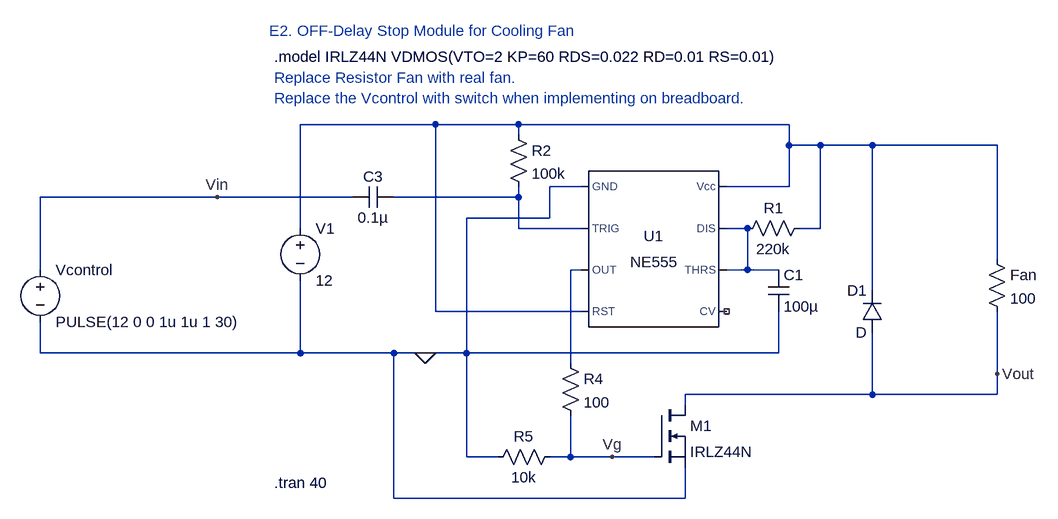
[diagram p0: schematic OFF-Delay Stop Module for DC Load .asc]
OFF-Delay Stop Module for DC Load .asc, the LTspice schematic file:
Version 4
SHEET 1 1632 688
WIRE 512 -16 304 -16
WIRE 640 -16 512 -16
WIRE 1056 -16 640 -16
WIRE 640 0 640 -16
WIRE 1056 16 1056 -16
WIRE 1104 16 1056 16
WIRE 1184 16 1104 16
WIRE 1376 16 1184 16
WIRE 736 80 688 80
WIRE 1056 80 1056 16
WIRE 1056 80 960 80
WIRE 176 96 -96 96
WIRE 384 96 176 96
WIRE 640 96 640 80
WIRE 640 96 448 96
WIRE 688 128 688 80
WIRE 688 128 560 128
WIRE 304 144 304 -16
WIRE 640 144 640 96
WIRE 736 144 640 144
WIRE 992 144 960 144
WIRE 1104 144 1104 16
WIRE 1104 144 1072 144
WIRE 1376 192 1376 16
WIRE -96 208 -96 96
WIRE 736 208 720 208
WIRE 992 208 992 144
WIRE 992 208 960 208
WIRE 1040 208 992 208
WIRE 1184 240 1184 16
WIRE 512 272 512 -16
WIRE 736 272 512 272
WIRE -96 336 -96 288
WIRE 304 336 304 224
WIRE 304 336 -96 336
WIRE 448 336 304 336
WIRE 496 336 448 336
WIRE 560 336 560 128
WIRE 560 336 496 336
WIRE 1040 336 1040 272
WIRE 1040 336 560 336
WIRE 720 352 720 208
WIRE 1376 368 1376 272
WIRE 1184 400 1184 304
WIRE 1184 400 896 400
WIRE 1376 400 1376 368
WIRE 1376 400 1184 400
WIRE 896 416 896 400
WIRE 560 496 560 336
WIRE 608 496 560 496
WIRE 720 496 720 432
WIRE 720 496 688 496
WIRE 784 496 720 496
WIRE 848 496 784 496
WIRE 448 560 448 336
WIRE 896 560 896 512
WIRE 896 560 448 560
FLAG 496 336 0
FLAG 1376 368 Vout
FLAG 784 496 Vg
FLAG 176 96 Vin
SYMBOL Misc\\NE555 848 176 R0
SYMATTR InstName U1
SYMBOL voltage 304 128 R0
SYMATTR InstName V1
SYMATTR Value 12
SYMBOL res 1088 128 R90
WINDOW 0 0 56 VBottom 2
WINDOW 3 32 56 VTop 2
SYMATTR InstName R1
SYMATTR Value 220k
SYMBOL cap 1024 208 R0
SYMATTR InstName C1
SYMATTR Value 100µ
SYMBOL res 624 -16 R0
SYMATTR InstName R2
SYMATTR Value 100k
SYMBOL voltage -96 192 R0
SYMATTR InstName Vcontrol
SYMATTR Value PULSE(12 0 0 1u 1u 1 30)
SYMBOL cap 448 80 R90
WINDOW 0 0 32 VBottom 2
WINDOW 3 32 32 VTop 2
SYMATTR InstName C3
SYMATTR Value 0.1µ
SYMBOL res 704 336 R0
SYMATTR InstName R4
SYMATTR Value 100
SYMBOL nmos 848 416 R0
SYMATTR InstName M1
SYMATTR Value IRLZ44N
SYMBOL res 704 480 R90
WINDOW 0 0 56 VBottom 2
WINDOW 3 32 56 VTop 2
SYMATTR InstName R5
SYMATTR Value 10k
SYMBOL diode 1200 304 R180
WINDOW 0 24 64 Left 2
WINDOW 3 24 0 Left 2
SYMATTR InstName D1
SYMBOL res 1360 176 R0
SYMATTR InstName Fan
SYMATTR Value 100
TEXT 264 536 Left 2 !.tran 40
TEXT 264 -120 Left 2 !.model IRLZ44N VDMOS(VTO=2 KP=60 RDS=0.022 RD=0.01 RS=0.01)
TEXT 256 -160 Left 2 ;E2. OFF-Delay Stop Module for Cooling Fan
TEXT 264 -88 Left 2 ;Replace Resistor Fan with real fan.\nReplace the Vcontrol with switch when implementing on breadboard.

The netlist it stands for:
* OFF-Delay Stop Module for DC Load .asc
XU1 0 N002 N004 N001 NC_01 N003 N003 N001 NE555  ; pins GND TRIG OUT RST CV THRS DIS Vcc
V1 N001 0 12
R1 N001 N003 220k
C1 N003 0 100µ
R2 N001 N002 100k
Vcontrol Vin 0 PULSE(12 0 0 1u 1u 1 30)
C3 N002 Vin 0.1µ
R4 N004 Vg 100
M1 Vout Vg 0 0 IRLZ44N
R5 Vg 0 10k
D1 Vout N001 D
R§Fan N001 Vout 100
.model D D
.lib standard.dio
.model NMOS NMOS
.model PMOS PMOS
.lib standard.mos
.tran 40
.model IRLZ44N VDMOS(VTO=2 KP=60 RDS=0.022 RD=0.01 RS=0.01)
* E2. OFF-Delay Stop Module for Cooling Fan
* Replace Resistor Fan with real fan.
* Replace the Vcontrol with switch when implementing on breadboard.
.lib NE555.sub
.backanno
.end